# Altium schematic sheet CAN.SchDoc: =AM_Title
size A3; CompanyName: Antmicro Ltd; Address1: Zwierzyniecka 3; Address2: 60-813 Poznań; Address3: Poland; Address4: 60-813 Poznań, Poland; SheetNumber: 1; SheetTotal: 1; PageSetup: Record=PageOptions|CenterHorizontal=True|CenterVertical=True|PrintScale=0.97|XCorrection=1.00|YCorrection=1.00|PrintKind=1|BorderSize=5000000|LeftOffset=0|BottomOffset=0|Orientation=2|PaperLength=2970|PaperWidth=2100|Scale=100|PaperSource=7|PrintQuality=600|MediaType=1|DitherType=10|PaperKind=A4|PrintScaleMode=1
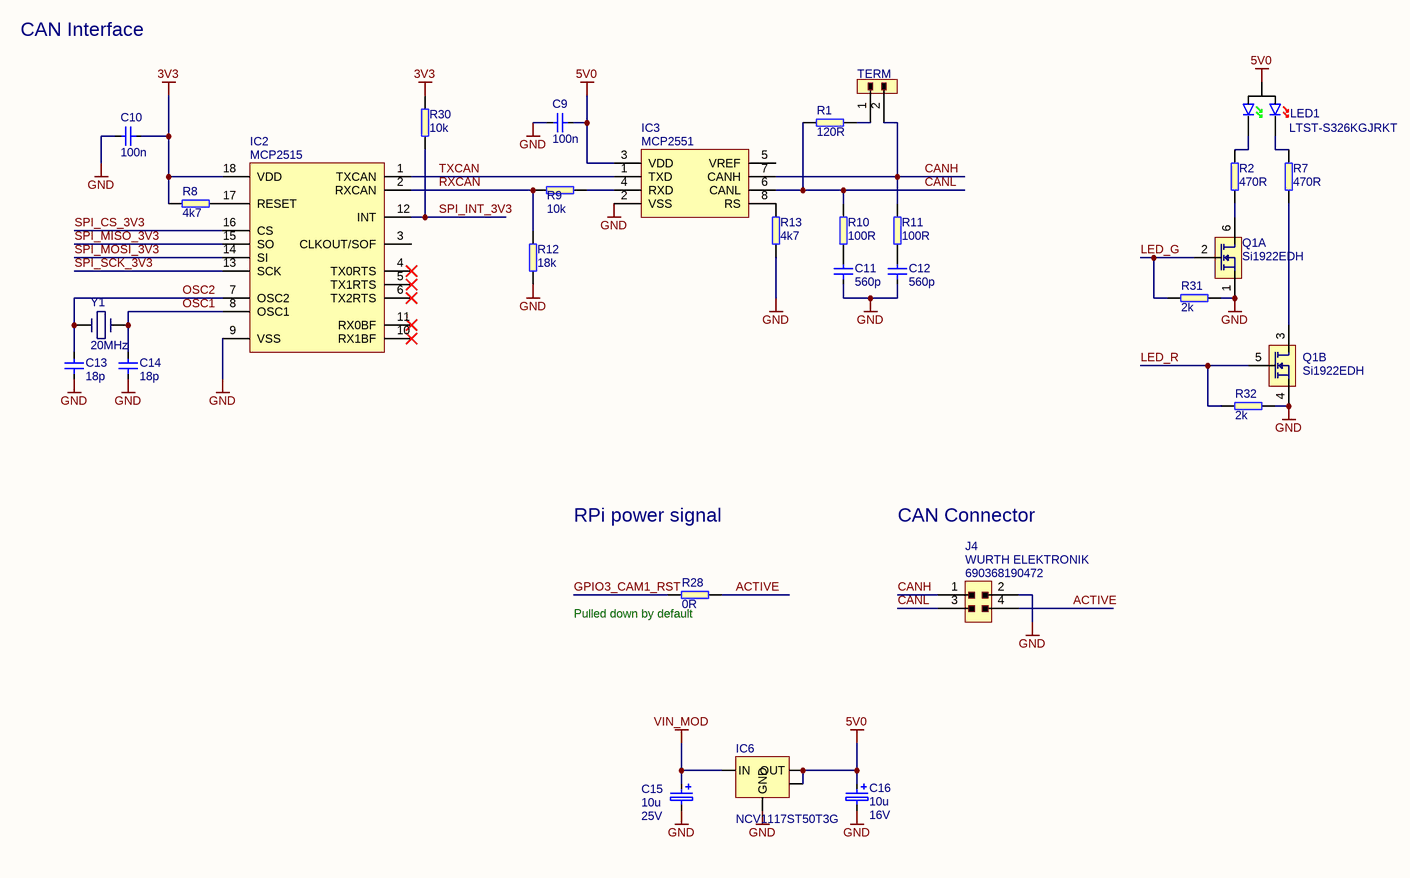
[diagram p0: CAN.SchDoc]

## Parts
C9  100n  [0402]
C10  100n  [0402]
C11  560p  [0603]
C12  560p  [0603]
C13  18p  [0402]
C14  18p  [0402]
C15  value 10u  Voltage: 25V  [KEMET_C]  (hidden comment: CPol)
C16  Voltage: 16V  [KEMET_A]  (hidden comment: 10u)
IC2  MCP2515  [SOIC-18]
IC3  MCP2551  [SOIC-8]
IC6  value NCV1117ST50T3G  [SOT223]  (hidden comment: xx1117)
J4  Manufacturer: WURTH ELEKTRONIK  Part Symbol: 690368190472  [WE_690368190472]  (hidden comment: WE_690368190472)
LED1  Part Symbol: LTST-S326KGJRKT  [LED-LiteON-LTST-S326KGJRKT]  (hidden comment: LED-LiteON-LTST-S326KGJRKT)
Q1  Si1922EDH  [SOT-363]  (parts A,B of 2)
R1  120R  [0603]
R2  470R  [0603]
R7  470R  [0603]
R8  4k7  [0603]
R9  10k  [0603]
R10  100R  [0603]
R11  100R  [0603]
R12  18k  [0603]
R13  4k7  [0603]
R28  0R  [0603]
R30  10k  [0603]
R31  2k  [0603]
R32  2k  [0603]
TERM  HEADER_1X2_male  [HEADER_1X2_male 2.54mm]  (value not drawn)
Y1  20MHz  [TXC_7A]

## Nets
3V3: C10.1 IC2.18(VDD) R8.2 R30.2
5V0: C9.1 C16.1 IC3.3(VDD) IC6.2(OUT) IC6.4(OUT) LED1.A
GND: C9.2 C10.2 C11.1 C12.1 C13.1 C14.1 C15.2 C16.2 IC2.9(VSS) IC3.2(VSS) IC6.1(GND) J4.2 Q1.1(S1) Q1.4(S2) R12.1 R13.1 R31.2 R32.2
VIN_MOD: C15.1 IC6.3(IN)
ACTIVE: J4.4 R28.2
CANH: IC3.7(CANH) J4.1 R11.2 TERM.2
CANL: IC3.6(CANL) J4.3 R1.1 R10.2
GPIO3_CAM1_RST: R28.1
LED_G: Q1.2(G1) R31.1
LED_R: Q1.5(G2) R32.1
OSC1: C14.2 IC2.8(OSC1) Y1.1
OSC2: C13.2 IC2.7(OSC2) Y1.2
RXCAN: IC2.2(RXCAN) R9.1 R12.2
SPI_CS_3V3: IC2.16(CS)
SPI_INT_3V3: IC2.12(INT) R30.1
SPI_MISO_3V3: IC2.15(SO)
SPI_MOSI_3V3: IC2.14(SI)
SPI_SCK_3V3: IC2.13(SCK)
TXCAN: IC2.1(TXCAN) IC3.1(TXD)
NetC11_2: C11.2 R10.1
NetC12_2: C12.2 R11.1
NetIC2_17: IC2.17(RESET) R8.1
NetIC3_4: IC3.4(RXD) R9.2
NetIC3_8: IC3.8(RS) R13.2
NetLED1_C1: LED1.C1 R7.2
NetLED1_C2: LED1.C2 R2.2
NetQ1_3: Q1.3(D2) R7.1
NetQ1_6: Q1.6(D1) R2.1
NetR1_2: R1.2 TERM.1

Not connected (* = marked no-connect by the designer): IC2 3(CLKOUT/SOF) 4(TX0RTS)* 5(TX1RTS)* 6(TX2RTS)* 10(RX1BF)* 11(RX0BF)*; IC3 5(VREF)

## Notes on the sheet
- CAN Interface
- RPi power signal
- CAN Connector
- (near R28) Pulled down by default
- Title:
- Drawn by:
- Size:
- Date:
- Approved by:
- A3
- Revision:
- Page:
- of
- www.antmicro.com
- File:

## Library data of the parts
C9 C10 = C_100n_0402: MLCC SMT Capacitor 100nF 0402; Manufacturer: MULTICOMP; Part Symbol: MC0402X104M100CT; Value: 100n; Part Number: C_100n_0402; Supplier 1: Farnell; Supplier Part Number 1: 2309011
C11 C12 = C_560p_0603: MLCC SMT Capacitor 560pF 0603; Manufacturer: MULTICOMP; Part Symbol: MC0603N561J500CT; Value: 560p; Part Number: C_560p_0603; Supplier 1: Farnell; Supplier Part Number 1: 1759082
C13 C14 = C_18p_0402: MLCC SMT Capacitor 18pF 0603; Manufacturer: KEMET; Part Symbol: C0402C180J5GACAUTO; Value: 18p; Part Number: C_18p_0402; Supplier 1: Farnell; Supplier Part Number 1: 2070379
C15 = C_10u_KEMET_C: Tantalum SMT Capacitor 10uF Case KEMET_C; Manufacturer: KEMET; Part Symbol: T491C106K025AT; Part Number: C_10u_KEMET_C; Supplier 1: Farnell; Supplier Part Number 1: 1457463
C16 = C_10u_KEMET_A: Tantalum SMT Capacitor 10uF Case KEMET_A; Manufacturer: VISHAY; Part Symbol: 293D106X9016A2TE3; Value: 10u; Part Number: C_10u_KEMET_A; Supplier 1: Farnell; Supplier Part Number 1: 1754182
IC2 = MCP2515-I/SO: CAN CONTROLLER, SPI, 1MBPS; Manufacturer: MICROCHIP; Supplier 1: Farnell; Supplier Part Number 1: 1292239; Part Number: MCP2515-I/SO; Value: MCP2515; Part Symbol: MCP2515-I/SO
IC3 = MCP2551-I/SN: MCP2551-I/SN  IC, CAN TRANSCEIVER, HI SPEED, SMD; Manufacturer: MICROCHIP; Supplier 1: Farnell; Supplier Part Number 1: 9758569; Part Number: MCP2551-I/SN; Value: MCP2551; Part Symbol: MCP2551-I/SN
IC6 = xx1117: ON SEMICONDUCTOR  NCV1117ST50T3G  Fixed LDO Voltage Regulator, 20V in, 1.07V Dropout, 5V/1A out, SOT-223-3; Part Number: NCV1117ST50T3G; Supplier 1: Farnell; Supplier Part Number 1: 2534280; Manufacturer: ON SEMICONDUCTOR; Part Symbol: NCV1117ST50T3G
LED1 = LED-LiteON-LTST-S326KGJRKT: Standard LEDs - SMD Green/Red Clear 571nm/631nm; Manufacturer: Lite-On; Part Number: LED-LiteON-LTST-S326KGJRKT; Value: LED-LiteON-LTST-S326KGJRKT; Supplier 1: Mouser; Supplier Part Number 1: 859-LTST-S326KGJRKT
Q1 = Si1922EDH: 20 V, dual N-channel Trench MOSFET; Manufacturer: Vishay; Part Number: Si1922EDH; Value: Si1922EDH; Supplier 1: Farnell; Supplier Part Number 1: 2056714; Part Symbol: Si1922EDH
R1 = R_120R_0603: SMT Resistor 120R 0603; Manufacturer: VISHAY; Part Symbol: CRCW0603120RFKEA; Tolerance: 1%; Value: 120R; Part Number: R_120R_0603; Supplier 1: Farnell; Supplier Part Number 1: 1652832
R2 R7 = R_470R_0603: SMT Resistor 470R 0603; Manufacturer: BOURNS; Part Symbol: CR0603-JW-471GLF; Value: 470R; Part Number: R_470R_0603; Supplier 1: Farnell; Supplier Part Number 1: 2008354
R8 R13 = R_4k7_0603: SMT Resistor 4k7 0603; Manufacturer: BOURNS; Part Symbol: CR0603-FX-4701ELF; Value: 4k7; Part Number: R_4k7_0603; Supplier 1: Farnell; Supplier Part Number 1: 2008340
R9 R30 = R_10k_0603: SMT Resistor 10k 0603; Manufacturer: BOURNS; Part Symbol: CR0603-JW-103ELF; Value: 10k; Part Number: R_10k_0603; Supplier 1: Farnell; Supplier Part Number 1: 2008360
R10 R11 = R_100R_0603: SMT Resistor 100R 0603; Manufacturer: MULTICOMP; Part Symbol: MC0063W06035100R; Tolerance: 5%; Value: 100R; Part Number: R_100R_0603; Supplier 1: Farnell; Supplier Part Number 1: 9331689
R12 = R_18k_0603: SMT Resistor 18k 0603; Manufacturer: MULTICOMP; Part Symbol: MC0063W0603118K; Tolerance: 1%; Value: 18k; Part Number: R_18k_0603; Supplier 1: Farnell; Supplier Part Number 1: 9330720
R28 = R_0R_0603: SMT Resistor 0R 0603; Manufacturer: BOURNS; Part Symbol: CR0603-J/-000ELF; Tolerance: 5%; Part Number: R_0R_0603; Value: 0R; Supplier 1: Farnell; Supplier Part Number 1: 2008343
R31 R32 = R_2k_0603: SMT Resistor 2k 0603; Manufacturer: MULTICOMP; Part Symbol: MCMR06X2001FTL; Value: 2k; Part Number: R_2k_0603; Supplier 1: Farnell; Supplier Part Number 1: 2073418
TERM = HEADER_1X2_male: 1x2 pinhead male; Part Number: HEADER_1X2_male
Y1 = CRYSTAL_20MHz_SMD_TXC: CRYSTAL, 20.000MHZ; Manufacturer: TXC; Part Symbol: 7A-20.000MAAJ-T; Value: 20MHz; Part Number: CRYSTAL_20MHz_SMD_TXC; Supplier 1: Farnell; Supplier Part Number 1: 1841950
J4 = WE_690368190472: Part Number: WE_690368190472; Value: WE_690368190472